# EAGLE schematic decoder (EAGLE 6.3)
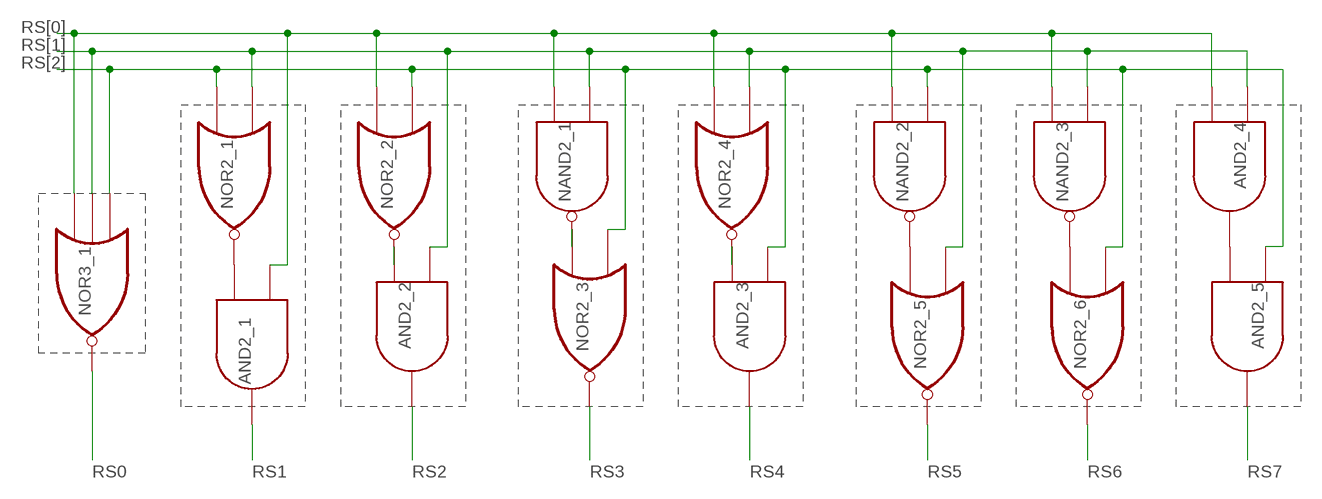
[diagram p0: schematic, sheet 1]

## Parts
AND2_1  AND2  [3PIN]
AND2_2  AND2  [3PIN]
AND2_3  AND2  [3PIN]
AND2_4  AND2  [3PIN]
AND2_5  AND2  [3PIN]
NAND2_1  NAND2  [3PIN]
NAND2_2  NAND2  [3PIN]
NAND2_3  NAND2  [3PIN]
NOR2_1  NOR2  [3PIN]
NOR2_2  NOR2  [3PIN]
NOR2_3  NOR2  [3PIN]
NOR2_4  NOR2  [3PIN]
NOR2_5  NOR2  [3PIN]
NOR2_6  NOR2  [3PIN]
NOR3_1  NOR3  [5PIN]

## Nets
N$1: AND2_1.P$2(I1) NOR2_1.P$3(O)
N$2: AND2_2.P$2(I1) NOR2_2.P$3(O)
N$3: NAND2_1.P$3(O) NOR2_3.P$2(I1)
N$4: AND2_3.P$2(I1) NOR2_4.P$3(O)
N$5: NAND2_2.P$3(O) NOR2_5.P$2(I1)
N$6: NAND2_3.P$3(O) NOR2_6.P$2(I1)
N$7: AND2_4.P$3(O) AND2_5.P$2(I1)
RS0: NOR3_1.P$4(O)
RS1: AND2_1.P$3(O)
RS2: AND2_2.P$3(O)
RS3: NOR2_3.P$3(O)
RS4: AND2_3.P$3(O)
RS5: NOR2_5.P$3(O)
RS6: NOR2_6.P$3(O)
RS7: AND2_5.P$3(O)
RS[0]: AND2_1.P$1(A) AND2_4.P$2(I1) NAND2_1.P$2(I1) NAND2_2.P$2(I1) NAND2_3.P$2(I1) NOR2_2.P$2(I1) NOR2_4.P$2(I1) NOR3_1.P$2(I1)
RS[1]: AND2_2.P$1(A) AND2_4.P$1(A) NAND2_1.P$1(A) NAND2_3.P$1(A) NOR2_1.P$1(I0) NOR2_4.P$1(I0) NOR2_5.P$1(I0) NOR3_1.P$3(I2)
RS[2]: AND2_3.P$1(A) AND2_5.P$1(A) NAND2_2.P$1(A) NOR2_1.P$2(I1) NOR2_2.P$1(I0) NOR2_3.P$1(I0) NOR2_6.P$1(I0) NOR3_1.P$1(I0)

## Library data of the parts
AND2_1-AND2_5 = c035u:AND2
NAND2_1-NAND2_3 = c035u:NAND2
NOR2_1-NOR2_6 = c035u:NOR2
NOR3_1 = c035u:NOR3